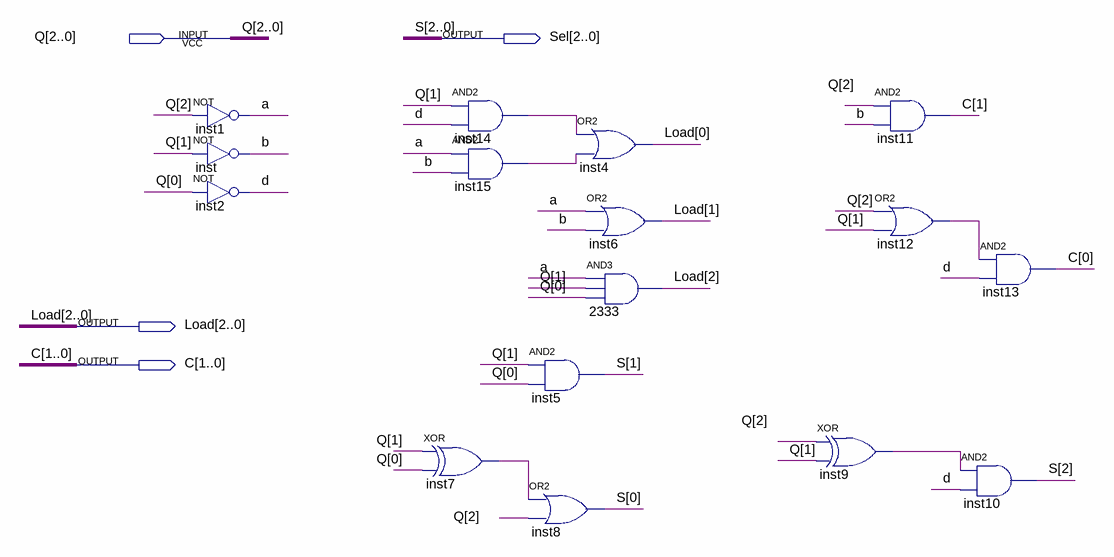
[diagram p0: schematic sheet]
// Quartus schematic Output_Logic_2.bdf as structural Verilog: 16 symbols, 4 pins
module Output_Logic_2 (
  input  [2:0] Q,
  output [2:0] Sel,
  output [2:0] Load,
  output [1:0] C
);

  wire a, b, d, inst7_out, inst9_out, inst12_out, inst14_out, inst15_out;

  not inst1 (a, Q[2]);
  not inst (b, Q[1]);
  not inst2 (d, Q[0]);
  xor inst7 (inst7_out, Q[1], Q[0]);
  and inst14 (inst14_out, Q[1], d);
  and inst15 (inst15_out, a, b);
  or inst4 (Load[0], inst14_out, inst15_out);
  or inst6 (Load[1], a, b);
  and u_2333 (Load[2], a, Q[1], Q[0]);
  and inst5 (Sel[1], Q[1], Q[0]);
  or inst8 (Sel[0], inst7_out, Q[2]);
  xor inst9 (inst9_out, Q[2], Q[1]);
  and inst11 (C[1], Q[2], b);
  or inst12 (inst12_out, Q[2], Q[1]);
  and inst13 (C[0], inst12_out, d);
  and inst10 (Sel[2], inst9_out, d);

  // Other names for the same wires on the sheet: S[2:0] = Sel
endmodule
